# EAGLE design ELASORB01 (EAGLE 7.2.0)
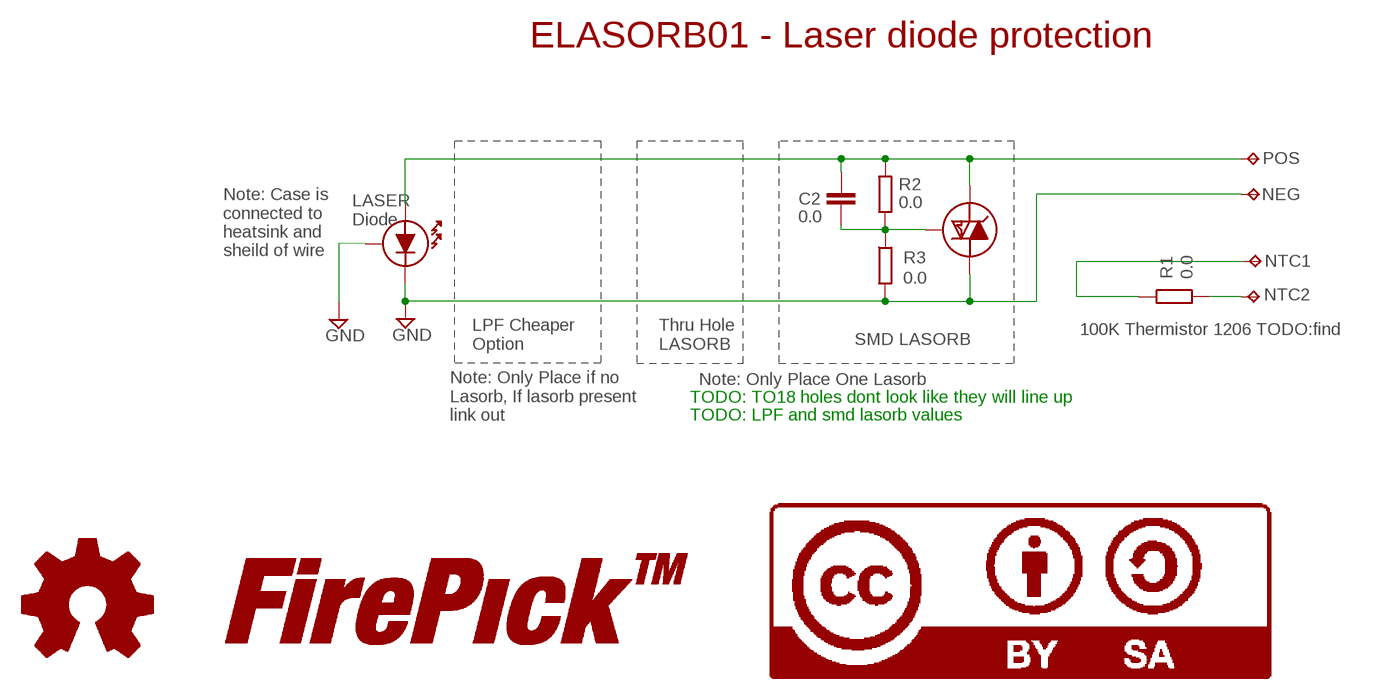
[diagram p0: schematic, sheet 1]

## Parts
C2  0.0  C-EUC0603K  [C0603K]
D1  LASER_DIODE  [TO18]
LOGO1  LOGO-CC-BY-SASMALL  [LOGO-CC-BY-SA-SMALL]
LOGO2  LOGO-FIREPICKSMALL  [LOGO-FIREPICK-SMALL]
LOGO3  LOGO-OSHWSMALL  [LOGO-OSHW-SMALL]
NEG  TPTP16R  [TP16R]
NTC1  TPTP16R  [TP16R]
NTC2  TPTP16R  [TP16R]
POS  TPTP16R  [TP16R]
R1  0.0  R-EU_R1206  [R1206]
R2  0.0  R-EU_R0603  [R0603]
R3  0.0  R-EU_R0603  [R0603]
U2  LASORB_SMD  [TSOP-6]

## Nets
GND: D1.2(CASE) D1.3(K) NEG.TP R3.2 U2.P$4(LDK)
N$1: NTC2.TP R1.2
N$2: NTC1.TP R1.1
N$3: C2.1 D1.1(A) POS.TP R2.2 U2.P$1(LDA) U2.P$2(LDA) U2.P$5(LDA) U2.P$6(LDA)
N$6: C2.2 R2.1 R3.1 U2.P$3(3-TRIG)

## Notes on the sheet
- ELASORB01 - Laser diode protection
- LASER 
  Diode
- Note: Case is 
  connected to 
  heatsink and 
  sheild of wire
- 100K Thermistor 1206 TODO:find
- SMD LASORB
- LPF Cheaper 
  Option
- Thru Hole 
  LASORB
- Note: Only Place One Lasorb
- TODO: TO18 holes dont look like they will line up
- Note: Only Place if no 
  Lasorb, If lasorb present 
  link out
- TODO: LPF and smd lasorb values

## Library data of the parts
C2 = rcl:C-EU: CAPACITOR, European symbol
D1 = lasorb:LASER_DIODE
LOGO1 = FirePick (2):LOGO-CC-BY-SA; BOM: EXCLUDE; DNP: T
LOGO2 = FirePick (2):LOGO-FIREPICK; BOM: EXCLUDE; DNP: T
LOGO3 = FirePick (2):LOGO-OSHW; BOM: EXCLUDE; DNP: TRUE
NEG NTC1 NTC2 POS = testpad:TP: Test pad
R1-R3 = rcl:R-EU_: RESISTOR, European symbol
U2 = lasorb:LASORB_SMD

## Board
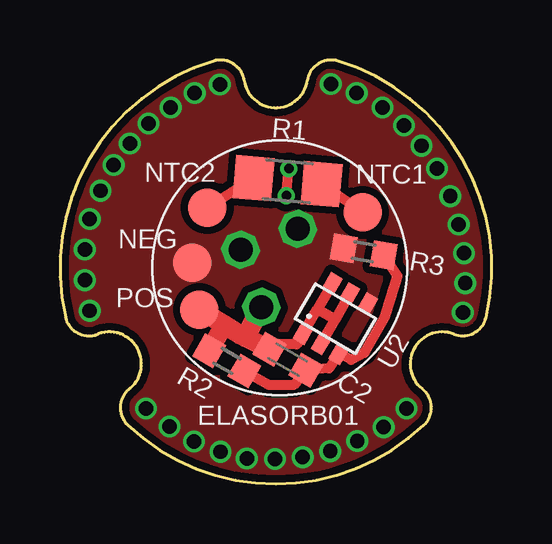
[diagram p1: board, top side]
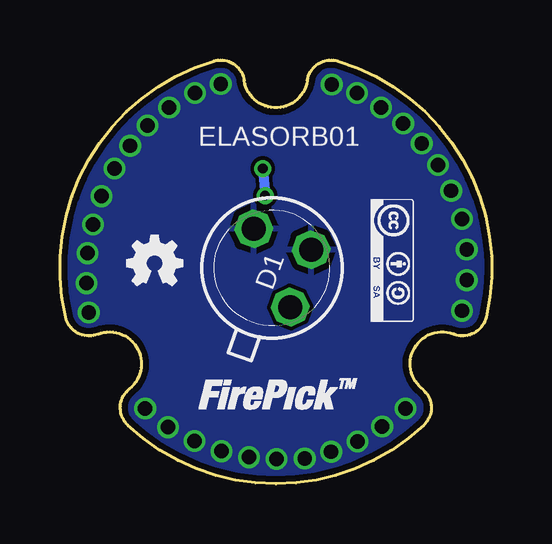
[diagram p2: board, bottom side, seen from below]

Size 17.98 x 17.66 mm. Coordinates in mm from the lower left corner, seen from the top.
Outline: 7.68,16.81 arc163 10.31,16.81 arc-98 11.59,17.62 arc-87 17.75,6.94 arc-98 16.41,6.24 arc163 15.09,3.96 arc-98 15.16,2.45 arc-86 2.83,2.44 arc-96 2.87,3.94 2.92,3.99 arc160 1.6,6.25 1.55,6.23 arc-97 0.23,6.94 arc-86 6.4,17.62 arc-98 7.68,16.81
Copper layers (1*16): Top 0.035mm / dielectric 1.5mm / Bottom 0.035mm
Design rules "SeeedStudio_2layer_DRU_no_angle_20140221": minimum track width 6mil, minimum drill 12mil, track to track 6mil, track to pad 6mil, pad to pad 6mil, via to via 6mil, smd to smd 0mil, copper to edge 10mil, drill to drill 10mil, minimum pad ring 10mil, minimum via ring 6mil, stop-mask expansion 2mil, vias tented up to drill 100mil, thermal gap 10mil

### Footprints (pad centres in the part's own frame; a part is rotated, then mirrored left to right if it is on the bottom)
C0603K = smd 1.05 x 1.08: 1 -0.875,0; 2 0.875,0
TO18 = drill 1 octagon: 1 -1.27,-1.27; 2 1.27,-1.27; 3 1.27,1.27
TP16R = smd 1.6 x 1.6: TP 0,0
R1206 = smd 1.6 x 1.803: 1 -1.422,0; 2 1.422,0
R0603 = smd 1 x 1.1: 1 -0.85,0; 2 0.85,0
TSOP-6 = smd 0.55 x 0.8: P$1 2.4,0.35; P$2 1.55,0.35; P$3 0.7,0.35; P$4 0.7,-2.05; P$5 1.55,-2.05; P$6 2.4,-2.05

### Placement (x,y rotation side)
C2  9.49,5.18 330 top
D1  9.15,9 70 bottom
LOGO1  5.04,11.86 270 bottom
LOGO2  12.21,3.11 0 bottom
LOGO3  15.29,8.06 0 bottom
NEG  5.51,9.21 0 top
NTC1  12.61,11.31 0 top
NTC2  6.14,11.51 0 top
POS  5.81,7.26 0 top
R1  9.49,12.61 175 top
R2  6.95,5.13 150 top
R3  12.66,9.67 170 top
U2  12.4,5.37 150 top

### Tracks (layer width: path | path; a pad name or v marks a point on that pad's centre or on a via)
GND  (via drill 0.6)
  other vias: 6.66,16.64 5.61,16.29 4.61,15.69 3.69,15.01 2.91,14.19 2.24,13.29 1.69,12.21 1.24,11.04 1.04,9.76 1.04,8.49 1.24,7.21 11.29,16.66 16.79,7.14 12.36,16.29 13.44,15.69 16.89,8.36 16.84,9.61 16.61,10.81 14.34,14.94 15.06,14.09 15.71,13.14 16.26,11.99 14.44,3.14 3.59,3.14 4.56,2.39 13.49,2.36 12.39,1.79 5.59,1.76 6.69,1.34 11.26,1.36 10.11,1.11 8.96,1.04 7.79,1.06
  pour Top (isolate 0.305, rank 4, no thermals): 7.11,18.54 14.94,17.91 19.44,10.59 17.41,2.76 11.11,-0.46 5.11,-0.41 -0.46,4.96 0.06,14.31
  pour Bottom: 0.94,3.71 4.79,0.19 8.89,-0.44 13.56,0.31 16.84,3.94 18.81,8.44 17.99,13.19 15.24,16.76 11.16,18.36 6.46,18.21 3.11,16.71 0.86,14.06 -0.29,11.21 -0.51,7.99 0.44,4.59
N$1
  Top 0.406: R1.2 NTC2.TP
N$2
  Top 0.406: NTC1.TP R1.1
N$3
  Top 0.406: C2.1 8.86,5.81 9.86,5.81 U2.P$1 10.72,7.28 | U2.P$2 11.46,6.84 | 11.46,6.84 10.72,7.28 | U2.P$5 11.46,6.84 | U2.P$6 10.72,7.28
  Top 0.813: C2.1 7.72,6.11 | 7.72,6.11 7.52,6.22 6.85,6.62 | 6.85,6.62 POS.TP | R2.2 6.85,6.62 | D1.1 7.72,6.11
N$5  (via drill 0.4)
  Top 0.406: v9.44,12.01 v9.54,13.14
  Bottom 0.406: v9.54,13.14 v9.44,12.01
N$6
  Top 0.406: R3.1 14.06,8.66 13.51,6.91 12.69,5.46 12.14,5.16 U2.P$3 11.21,4.81 C2.2 9.74,4.11 8.71,4.11 R2.1

### Text on the board
tNames: ELASORB01
bNames: ELASORB01